# Altium project CFD_V1.03.PrjPcb (part 1 of 2)
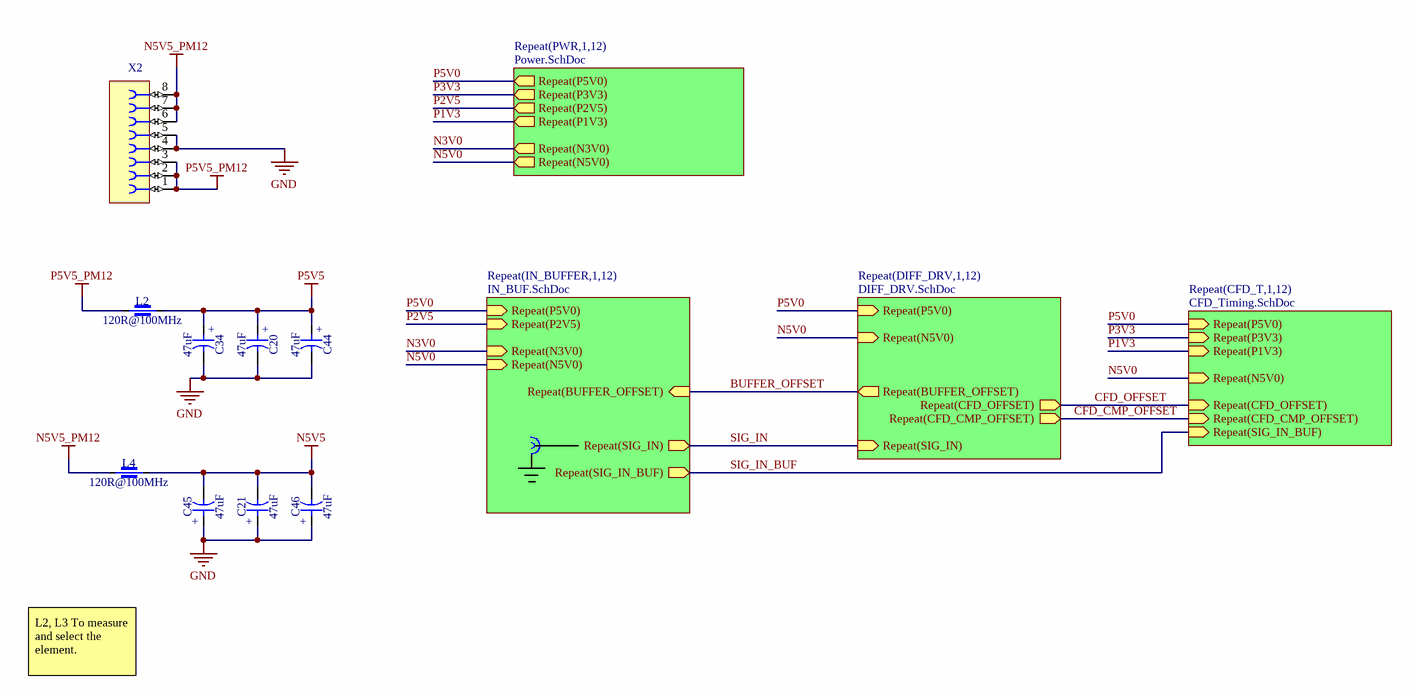
[diagram p0: CFD_V1.03_Main.SchDoc]
5 sheets, 1353 parts. Net scope: hierarchical (ports join the sheet entries above them; power ports are global).
Board file: CFD_V1.03.PcbDoc
Sheets:
  CFD_V1.03_Main.SchDoc
    PWR1 = Power.SchDoc
    PWR2 = Power.SchDoc
    PWR3 = Power.SchDoc
    PWR4 = Power.SchDoc
    PWR5 = Power.SchDoc
    PWR6 = Power.SchDoc
    PWR7 = Power.SchDoc
    PWR8 = Power.SchDoc
    PWR9 = Power.SchDoc
    PWR10 = Power.SchDoc
    PWR11 = Power.SchDoc
    PWR12 = Power.SchDoc
    IN_BUFFER1 = IN_BUF.SchDoc
    IN_BUFFER2 = IN_BUF.SchDoc
    IN_BUFFER3 = IN_BUF.SchDoc
    IN_BUFFER4 = IN_BUF.SchDoc
    IN_BUFFER5 = IN_BUF.SchDoc
    IN_BUFFER6 = IN_BUF.SchDoc
    IN_BUFFER7 = IN_BUF.SchDoc
    IN_BUFFER8 = IN_BUF.SchDoc
    IN_BUFFER9 = IN_BUF.SchDoc
    IN_BUFFER10 = IN_BUF.SchDoc
    IN_BUFFER11 = IN_BUF.SchDoc
    IN_BUFFER12 = IN_BUF.SchDoc
    DIFF_DRV1 = DIFF_DRV.SchDoc
    DIFF_DRV2 = DIFF_DRV.SchDoc
    DIFF_DRV3 = DIFF_DRV.SchDoc
    DIFF_DRV4 = DIFF_DRV.SchDoc
    DIFF_DRV5 = DIFF_DRV.SchDoc
    DIFF_DRV6 = DIFF_DRV.SchDoc
    DIFF_DRV7 = DIFF_DRV.SchDoc
    DIFF_DRV8 = DIFF_DRV.SchDoc
    DIFF_DRV9 = DIFF_DRV.SchDoc
    DIFF_DRV10 = DIFF_DRV.SchDoc
    DIFF_DRV11 = DIFF_DRV.SchDoc
    DIFF_DRV12 = DIFF_DRV.SchDoc
    CFD_T1 = CFD_Timing.SchDoc
    CFD_T2 = CFD_Timing.SchDoc
    CFD_T3 = CFD_Timing.SchDoc
    CFD_T4 = CFD_Timing.SchDoc
    CFD_T5 = CFD_Timing.SchDoc
    CFD_T6 = CFD_Timing.SchDoc
    CFD_T7 = CFD_Timing.SchDoc
    CFD_T8 = CFD_Timing.SchDoc
    CFD_T9 = CFD_Timing.SchDoc
    CFD_T10 = CFD_Timing.SchDoc
    CFD_T11 = CFD_Timing.SchDoc
    CFD_T12 = CFD_Timing.SchDoc

## Sheet CFD_V1.03_Main.SchDoc: ALICE FIT CFD Mezzanine
size 420 x 297 mm; CheckedBy: G.Kasprowicz; Author: INR Moscow; CompanyName: WUT ISE; DrawnBy: Maciej Podgóski; Organization: WUT ISE; Address1: PW ISE; Address2: Nowowiejska 15/19 00-665 Warsaw; Address3: gkasprow@gmail.com; DocumentNumber: 1; Revision: 2; SheetNumber: 1; SheetTotal: 5; ModifiedBy: -; CheckedDate: -; Title2: Top entity; DivGrp: WUT ISE; Designer: INR Moscow; ModifiedDate: -; ProjectName: Sensor Box

### Parts
C20  47uF  [CAPAE530X610N]
C21  47uF  [CAPAE530X610N]
C34  47uF  [CAPAE530X610N]
C44  47uF  [CAPAE530X610N]
C45  47uF  [CAPAE530X610N]
C46  47uF  [CAPAE530X610N]
L2  120R@100MHz  [IND_MURATA_BLM31KN]
L4  120R@100MHz  [IND_MURATA_BLM31KN]
X2  Socket 8  [SAMTEC_CES-108-01-T-S]  (value not drawn)

### Sub-sheets
Repeat(CFD_T,1,12) = CFD_Timing.SchDoc: Repeat(SIG_IN_BUF) (in), Repeat(CFD_CMP_OFFSET) (in), Repeat(P5V0) (in), Repeat(P3V3) (in), Repeat(P1V3) (in), Repeat(N5V0) (in), Repeat(CFD_OFFSET) (in)
Repeat(DIFF_DRV,1,12) = DIFF_DRV.SchDoc: Repeat(SIG_IN) (in), Repeat(BUFFER_OFFSET) (out), Repeat(CFD_CMP_OFFSET) (out), Repeat(P5V0) (in), Repeat(N5V0) (in), Repeat(CFD_OFFSET) (out)
Repeat(IN_BUFFER,1,12) = IN_BUF.SchDoc: Repeat(SIG_IN_BUF) (out), Repeat(SIG_IN) (out), Repeat(BUFFER_OFFSET) (in), Repeat(P5V0) (in), Repeat(P2V5) (in), Repeat(N5V0) (in), Repeat(N3V0) (in)
Repeat(PWR,1,12) = Power.SchDoc: Repeat(P5V0) (out), Repeat(P3V3) (out), Repeat(P2V5) (out), Repeat(P1V3) (out), Repeat(N3V0) (out), Repeat(N5V0) (out)

### Nets
GND: C20.2 C21.1 C34.2 C44.2 C45.1 C46.1 X2.4 X2.5
N5V5: C21.2 C45.2 C46.2 L4.2
N5V5_PM12: L4.1 X2.6 X2.7 X2.8
P5V5: C20.1 C34.1 C44.1 L2.2
P5V5_PM12: L2.1 X2.1 X2.2 X2.3
BUFFER_OFFSET: sheet Repeat(IN_BUFFER,1,12)/Repeat(BUFFER_OFFSET), sheet Repeat(DIFF_DRV,1,12)/Repeat(BUFFER_OFFSET)
CFD_CMP_OFFSET: sheet Repeat(DIFF_DRV,1,12)/Repeat(CFD_CMP_OFFSET), sheet Repeat(CFD_T,1,12)/Repeat(CFD_CMP_OFFSET)
CFD_OFFSET: sheet Repeat(DIFF_DRV,1,12)/Repeat(CFD_OFFSET), sheet Repeat(CFD_T,1,12)/Repeat(CFD_OFFSET)
N3V0: sheet Repeat(PWR,1,12)/Repeat(N3V0), sheet Repeat(IN_BUFFER,1,12)/Repeat(N3V0)
N5V0: sheet Repeat(PWR,1,12)/Repeat(N5V0), sheet Repeat(IN_BUFFER,1,12)/Repeat(N5V0), sheet Repeat(DIFF_DRV,1,12)/Repeat(N5V0), sheet Repeat(CFD_T,1,12)/Repeat(N5V0)
P1V3: sheet Repeat(PWR,1,12)/Repeat(P1V3), sheet Repeat(CFD_T,1,12)/Repeat(P1V3)
P2V5: sheet Repeat(PWR,1,12)/Repeat(P2V5), sheet Repeat(IN_BUFFER,1,12)/Repeat(P2V5)
P3V3: sheet Repeat(PWR,1,12)/Repeat(P3V3), sheet Repeat(CFD_T,1,12)/Repeat(P3V3)
P5V0: sheet Repeat(PWR,1,12)/Repeat(P5V0), sheet Repeat(IN_BUFFER,1,12)/Repeat(P5V0), sheet Repeat(DIFF_DRV,1,12)/Repeat(P5V0), sheet Repeat(CFD_T,1,12)/Repeat(P5V0)
SIG_IN: sheet Repeat(IN_BUFFER,1,12)/Repeat(SIG_IN), sheet Repeat(DIFF_DRV,1,12)/Repeat(SIG_IN)
SIG_IN_BUF: sheet Repeat(IN_BUFFER,1,12)/Repeat(SIG_IN_BUF), sheet Repeat(CFD_T,1,12)/Repeat(SIG_IN_BUF)

### Notes on the sheet
- L2, L3 To measure and select the element.
- Project/Equipment
- Document
- Designer
- Drawn by
- Check.by
- Copyright WUT ISE 2024.
  This documentation describes Open Hardware and is licensed under the CERN OHL v.2. You may redistribute and modify this documentation under the terms of the CERN OHL v.2. (http://ohwr.org/CERNOHL). This documentation is distributed WITHOUT ANY EXPRESS OR IMPLIED WARRANTY, INCLUDING OF MERCHANTABILITY, SATISFACTORY QUALITY AND FITNESS FOR A PARTICULAR PURPOSE. Please see the CERN OHL v.2 for applicable conditions.
- Contact
- File
- Last Mod.
- Print Date
- Sheet
- Size
- A3
- of
- Rev
- (in symbol CAE530-610_47UF_16V_20%) +

### Library data of the parts
C20 C21 C34 C44-C46 = CAE530-610_47UF_16V_20%: Polarised capacitor; Part Description: Conductive Polymer Hybrid Aluminum Electrolytic Capacitor; Manufacturer: CHEMI-CON; Manufacturer Part Number: HHXD160ARA470ME61G; Voltage: 16V; Tolerance: ±20%; Part Number: CAE530-610_47UF_16V_20%; Component Kind: Standard; Component Type: Standard; Pin Count: 2; Value: 47uF; Status: Not Recommended; Case: C; Mounted: Yes; Socket: No; SMD: Yes; Sense: No; ComponentHeight: 6.1mm; HelpURL: \\cern.ch\dfs\Applications\Altium\Datasheets\CAE_CHIMI-CON_HXD.pdf; Author: CERN DEM HF; CreateDate: 15.04.2024; LatestRevisionDate: 15.04.2024
L2 L4 = IND1206_MURATA_BLM31KN121SN1: Part Description: SMD Chip Ferrite Bead, BLM31KN_SN Series; Manufacturer: MURATA; Power: 6A; Resistance: 0.009R; Tolerance: ±25%; Part Number: IND1206_MURATA_BLM31KN121SN1; Component Kind: Standard; Component Type: Standard; Footprint: IND_MURATA_BLM31KN1; Pin Count: 2; Value: 120R@100MHz; Manufacturer Part Number: BLM31KN121SN1; Case: 1206; Mounted: Yes; Socket: No; SMD: Yes; Sense: No; ComponentHeight: 1.8mm; HelpURL: \\cern.ch\dfs\Applications\Altium\Datasheets\IND1206_MURATA_ BLM31KN_SN.pdf; Author: CERN DEM HF; CreateDate: 05.01.2022; LatestRevisionDate: 05.01.2022
X2 = SAMTEC_CES-108-01-L-S: Connector 8 Female; Part Description: 8 Contacts, Pitch 2.54mm, Single Row Through Mount Straight Socket (Lead Length 3.25mm); Manufacturer: SAMTEC; PressFit: No; Part Number: SAMTEC_CES-108-01-L-S; Component Kind: Standard; Component Type: Standard; Pin Count: 8; Family: Socket 8; Mounted: Yes; Socket: No; SMD: No; Sense: No; Status: None; Manufacturer Part Number: CES-108-01-L-S; ComponentHeight: 5.08mm; HelpURL: \\cern.ch\dfs\Applications\Altium\Datasheets\SAMTEC_CES-108-01-T-S.pdf; Author: CERN DEM HF; CreateDate: 25.04.2024; LatestRevisionDate: 25.04.2024

## Sheet Power.SchDoc: ALICE FIT CFD Mezzanine
size 420 x 297 mm; CheckedBy: G.Kasprowicz; Author: INR Moscow; CompanyName: WUT ISE; DrawnBy: Maciej Podgóski; Organization: WUT ISE; Address1: PW ISE; Address2: Nowowiejska 15/19 00-665 Warsaw; Address3: gkasprow@gmail.com; DocumentNumber: 4; Revision: 2; SheetNumber: 4; SheetTotal: 5; ModifiedBy: -; CheckedDate: -; Title2: Power supply; DivGrp: WUT ISE; Designer: INR Moscow; ModifiedDate: -; ProjectName: Sensor Box
Used 12 times, as channels PWR1, PWR2, PWR3, PWR4, PWR5, PWR6, PWR7, PWR8, PWR9, PWR10, PWR11, PWR12. Parts and nets are listed once, with the designators drawn on the sheet.
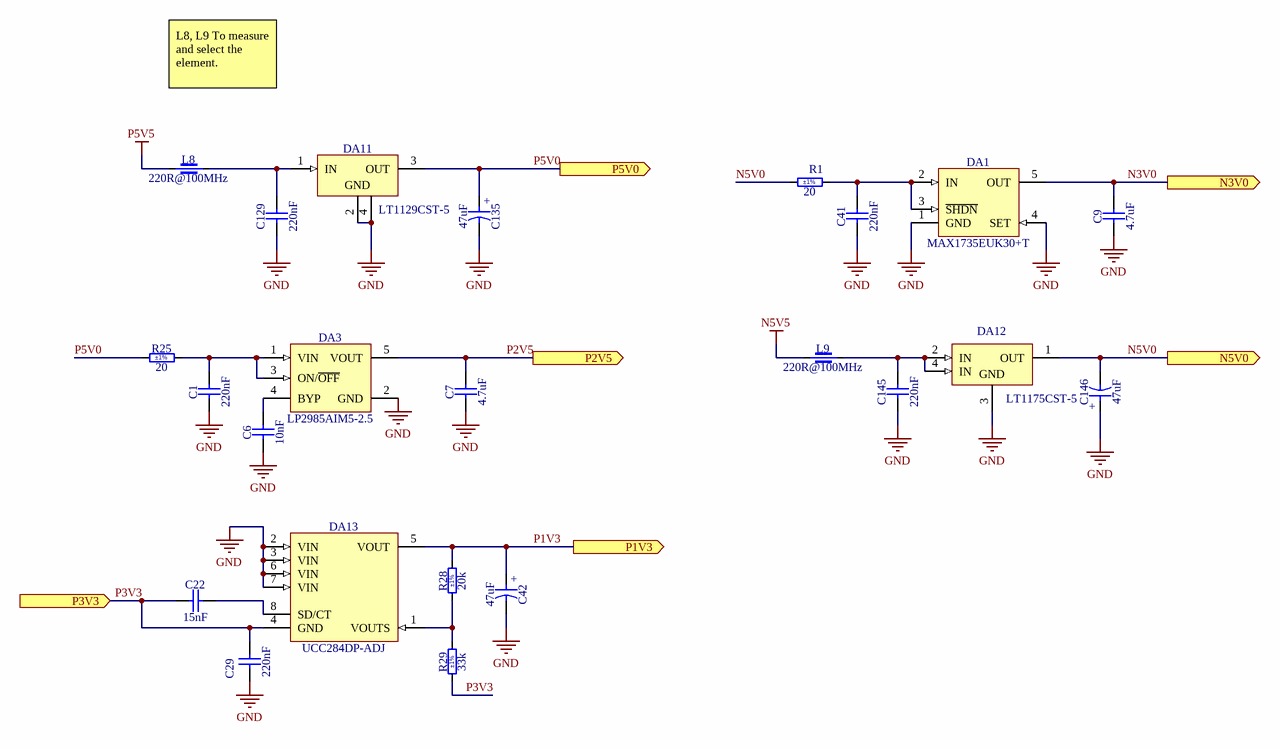
[diagram p1: Power.SchDoc]

### Parts
C1  220nF  [CAPC2012X135N]
C6  10nF  [CAPC2012X135N]
C7  4.7uF  [CAPC2012X135N]
C9  4.7uF  [CAPC2012X135N]
C22  15nF  [CAPC2012X135N]
C29  220nF  [CAPC2012X135N]
C41  220nF  [CAPC2012X135N]
C42  47uF  [CAPAE530X610N]
C129  220nF  [CAPC2012X135N]
C135  47uF  [CAPAE530X610N]
C145  220nF  [CAPC2012X135N]
C146  47uF  [CAPAE530X610N]
DA1  MAX1735EUK30+T  [SOT95P280X145-5N]
DA3  LP2985AIM5-2.5  [SOT95P280X145-5N]
DA11  LT1129CST-5  [SOT230P700X180-4N]
DA12  LT1175CST-5  [SOT230P700X180-4N]
DA13  UCC284DP-ADJ  [SOIC127P600X175-8N]
L8  220R@100MHz  [INDC2012X105N]
L9  220R@100MHz  [INDC2012X105N]
R1  20  Tolerance: ±1%  [RESC2012X60N]
R25  20  Tolerance: ±1%  [RESC2012X60N]
R28  20k  Tolerance: ±1%  [RESC2012X60N]
R29  33k  Tolerance: ±1%  [RESC2012X60N]

### Ports
N3V0 (out), N5V0 (out), P1V3 (out), P2V5 (out), P3V3 (in), P5V0 (out)

### Nets
GND: C1.1 C6.1 C7.1 C9.1 C29.1 C41.1 C42.2 C129.1 C135.2 C145.1 C146.1 DA1.1(GND) DA1.4(SET) DA3.2(GND) DA11.2(GND) DA11.4(GND) DA12.3(GND) DA13.2(VIN) DA13.3(VIN) DA13.6(VIN) DA13.7(VIN)
N5V5: L9.1
P5V5: L8.1
N3V0: C9.2 DA1.5(OUT) ; port N3V0
N5V0: C146.2 DA12.1(OUT) R1.1 ; port N5V0
P1V3: C42.1 DA13.5(VOUT) R28.2 ; port P1V3
P2V5: C7.2 DA3.5(VOUT) ; port P2V5
P3V3: C22.1 C29.2 DA13.4(GND) R29.1 ; port P3V3
P5V0: C135.1 DA11.3(OUT) R25.1 ; port P5V0
NetC1_2: C1.2 DA3.1(VIN) DA3.3(ON/~{OFF}) R25.2
NetC6_2: C6.2 DA3.4(BYP)
NetC22_2: C22.2 DA13.8(SD/CT)
NetC41_2: C41.2 DA1.2(IN) DA1.3(~{SHDN}) R1.2
NetC129_2: C129.2 DA11.1(IN) L8.2
NetC145_2: C145.2 DA12.2(IN) DA12.4(IN) L9.2
NetDA13_1: DA13.1(VOUTS) R28.1 R29.2

### Channels
PWR1: designators end in A; ports N3V0=N3V0 N5V0=N5V0 P1V3=P1V3 P2V5=P2V5 P3V3=P3V3 P5V0=P5V0
PWR2: designators end in B; ports N3V0=N3V0 N5V0=N5V0 P1V3=P1V3 P2V5=P2V5 P3V3=P3V3 P5V0=P5V0
PWR3: designators end in C; ports N3V0=N3V0 N5V0=N5V0 P1V3=P1V3 P2V5=P2V5 P3V3=P3V3 P5V0=P5V0
PWR4: designators end in D; ports N3V0=N3V0 N5V0=N5V0 P1V3=P1V3 P2V5=P2V5 P3V3=P3V3 P5V0=P5V0
PWR5: designators end in E; ports N3V0=N3V0 N5V0=N5V0 P1V3=P1V3 P2V5=P2V5 P3V3=P3V3 P5V0=P5V0
PWR6: designators end in F; ports N3V0=N3V0 N5V0=N5V0 P1V3=P1V3 P2V5=P2V5 P3V3=P3V3 P5V0=P5V0
PWR7: designators end in G; ports N3V0=N3V0 N5V0=N5V0 P1V3=P1V3 P2V5=P2V5 P3V3=P3V3 P5V0=P5V0
PWR8: designators end in H; ports N3V0=N3V0 N5V0=N5V0 P1V3=P1V3 P2V5=P2V5 P3V3=P3V3 P5V0=P5V0
PWR9: designators end in I; ports N3V0=N3V0 N5V0=N5V0 P1V3=P1V3 P2V5=P2V5 P3V3=P3V3 P5V0=P5V0
PWR10: designators end in J; ports N3V0=N3V0 N5V0=N5V0 P1V3=P1V3 P2V5=P2V5 P3V3=P3V3 P5V0=P5V0
PWR11: designators end in K; ports N3V0=N3V0 N5V0=N5V0 P1V3=P1V3 P2V5=P2V5 P3V3=P3V3 P5V0=P5V0
PWR12: designators end in L; ports N3V0=N3V0 N5V0=N5V0 P1V3=P1V3 P2V5=P2V5 P3V3=P3V3 P5V0=P5V0

### Notes on the sheet
- L8, L9 To measure and select the element.
- Project/Equipment
- Document
- Designer
- Drawn by
- Check.by
- Copyright WUT ISE 2024.
  This documentation describes Open Hardware and is licensed under the CERN OHL v.2. You may redistribute and modify this documentation under the terms of the CERN OHL v.2. (http://ohwr.org/CERNOHL). This documentation is distributed WITHOUT ANY EXPRESS OR IMPLIED WARRANTY, INCLUDING OF MERCHANTABILITY, SATISFACTORY QUALITY AND FITNESS FOR A PARTICULAR PURPOSE. Please see the CERN OHL v.2 for applicable conditions.
- Contact
- File
- Last Mod.
- Print Date
- Sheet
- Size
- A3
- of
- Rev
- (in symbol CAE530-610_47UF_16V_20%) +

### Library data of the parts
C1 C29 C41 C129 C145 = CC0805_220NF_50V_10%_X7R: Non-polarised capacitor; Part Description: SMD Multilayer Chip Ceramic Capacitor; Manufacturer: GENERIC; Manufacturer1 Part Number: GRM21BR71H224KA01L; Voltage: 50V; TC: X7R; Tolerance: ±10%; Part Number: CC0805_220NF_50V_10%_X7R; Component Kind: Standard; Component Type: Standard; Pin Count: 2; Value: 220nF; Status: Preferred; Manufacturer Part Number: CC0805_220NF_50V_10%_X7R; Case: 0805; Mounted: Yes; Socket: No; SMD: Yes; Sense: No; Manufacturer1 Example: MURATA; Manufacturer1 ComponentHeight: 1.35mm; HelpURL: \\cern.ch\dfs\Applications\Altium\Datasheets\CC0805_X7R_MURATA.pdf; Author: CERN DEM JLC; CreateDate: 03.12.2007; LatestRevisionDate: 03.12.2007
C6 = CC0805_10NF_50V_5%_C0G: Non-polarised capacitor; Part Description: SMD Multilayer Chip Ceramic Capacitor; Manufacturer: GENERIC; Manufacturer1 Part Number: C0805C103J5GACTU; Voltage: 50V; TC: C0G/NP0; Tolerance: ±5%; Part Number: CC0805_10NF_50V_5%_C0G; Component Kind: Standard; Component Type: Standard; Pin Count: 2; Value: 10nF; Status: None; Manufacturer Part Number: CC0805_10NF_50V_5%_C0G; Case: 0805; Mounted: Yes; Socket: No; SMD: Yes; Sense: No; Manufacturer1 Example: KEMET; Manufacturer1 ComponentHeight: 0.88mm; HelpURL: \\cern.ch\dfs\Applications\Altium\Datasheets\CC0805_C0G_KEMET_(Commercial Grade).pdf; Author: CERN DEM JLC; CreateDate: 02.02.2011; LatestRevisionDate: 22.04.2015
C7 C9 = CC0805_4.7UF_16V_10%_X7R: Non-polarised capacitor; Part Description: SMD Multilayer Chip Ceramic Capacitor; Manufacturer: GENERIC; Manufacturer1 Part Number: EMK212B7475KG-T; Voltage: 16V; TC: X7R; Tolerance: ±10%; Part Number: CC0805_4.7UF_16V_10%_X7R; Component Kind: Standard; Component Type: Standard; Pin Count: 2; Value: 4.7uF; Status: Preferred; Manufacturer Part Number: CC0805_4.7UF_16V_10%_X7R; Case: 0805; Mounted: Yes; Socket: No; SMD: Yes; Sense: No; Manufacturer1 Example: TAIYO YUDEN; Manufacturer1 ComponentHeight: 1.35mm; HelpURL: \\cern.ch\dfs\Applications\Altium\Datasheets\CC0805_X7R_TAIYO-YUDEN_HIGH-VALUE.pdf; Author: CERN DEM JLC; CreateDate: 16.09.2014; LatestRevisionDate: 16.09.2014
C22 = CC0805_15NF_50V_10%_X7R: Non-polarised capacitor; Part Description: SMD Multilayer Chip Ceramic Capacitor; Manufacturer: GENERIC; Manufacturer1 Part Number: 223858615638; Voltage: 50V; TC: X7R; Tolerance: ±10%; Part Number: CC0805_15NF_50V_10%_X7R; Component Kind: Standard; Component Type: Standard; Pin Count: 2; Value: 15nF; Status: Preferred; Manufacturer Part Number: CC0805_15NF_50V_10%_X7R; Case: 0805; Mounted: Yes; Socket: No; SMD: Yes; Sense: No; Manufacturer1 Example: PHYCOMP; Manufacturer1 ComponentHeight: 1.35mm; HelpURL: \\cern.ch\dfs\Applications\Altium\Datasheets\CC0805_X7R_PHYCOMP.pdf; Author: CERN DEM JLC; CreateDate: 03.12.2007; LatestRevisionDate: 03.12.2007
C42 C135 C146 = CAE530-610_47UF_16V_20%: as C20 on sheet CFD_V1.03_Main; Part Number: CAE530-610_47UF_16V_20%; Component Kind: Standard; Component Type: Standard; Pin Count: 2; Value: 47uF; Status: Not Recommended; Case: C; Mounted: Yes; Socket: No; SMD: Yes; Sense: No; ComponentHeight: 6.1mm; HelpURL: \\cern.ch\dfs\Applications\Altium\Datasheets\CAE_CHIMI-CON_HXD.pdf; Author: CERN DEM HF; CreateDate: 15.04.2024; LatestRevisionDate: 15.04.2024
DA1 = MAX1735EUK30+T: 200mA, Negative-Output, Low-Dropout Linear Regulator; Part Description: 3V, 200mA, Negative-Output, Low-Dropout Linear Regulator; Manufacturer: MAXIM; PressFit: No; Bonding: No; Part Number: MAX1735EUK30+T; Component Kind: Standard; Component Type: Standard; Device: MAX1735EUK30+T; PackageDescription: SOT23, 0.95mm Pitch; 5 Pin, 1.60mm W X 2.90mm L X 1.45mm H body, IPC Medium Density; Manufacturer Part Number: MAX1735EUK30; Pin Count: 5; Case: SOT23-5; Mounted: Yes; Socket: No; SMD: Yes; Sense: No; ComponentHeight: 1.45mm; HelpURL: \\cern.ch\dfs\Applications\Altium\Datasheets\MAX1735EUK30+T.pdf; Author: CERN DEM JLC; CreateDate: 17.02.2010; LatestRevisionDate: 04.04.2022
DA3 = LP2985AIM5-2.5: 150mA Low-Noise Low-Dropout Regulator Whit Shutdown; Part Description: 2.5V, 150mA Low-Noise Low-Dropout Regulator Whit Shutdown; Manufacturer: TEXAS INSTRUMENTS; PressFit: No; Bonding: No; Part Number: LP2985AIM5-2.5; Component Kind: Standard; Component Type: Standard; Device: LP2985AIM5-2.5; PackageDescription: SOT23, 0.95mm Pitch; 5 Pin, 1.60mm W X 2.90mm L X 1.45mm H body, IPC Medium Density; Manufacturer Part Number: LP2985AIM5-2.5; Pin Count: 5; Case: SOT23-5; Mounted: Yes; Socket: No; SMD: Yes; Sense: No; ComponentHeight: 1.45mm; HelpURL: \\cern.ch\dfs\Applications\Altium\Datasheets\LP2985AIM5.pdf; Author: CERN DEM HF; CreateDate: 16.04.2024; LatestRevisionDate: 16.04.2024
DA11 = LT1129CST-5: 3-Terminal Regulator 1=IN 2=GND 3=OUT 4=GND; Part Description: 5V, 700mA Micropower Low Dropout Regulator with Shutdown; Manufacturer: LINEAR TECHNOLOGY; PressFit: No; Bonding: No; Part Number: LT1129CST-5; Component Kind: Standard; Component Type: Standard; Device: LT1129CST-5; PackageDescription: SOT223, 2.30mm Pitch; 4 Pin, 3.70mm W X 6.70mm L X 1.80mm H body, IPC Medium Density; Manufacturer Part Number: LT1129CST-5; Pin Count: 4; Case: SOT223; Mounted: Yes; Socket: No; SMD: Yes; Sense: No; ComponentHeight: 1.8mm; HelpURL: \\cern.ch\dfs\Applications\Altium\Datasheets\LT1129.pdf; Author: CERN DEM HF; CreateDate: 16.04.2024; LatestRevisionDate: 16.04.2024
DA12 = LT1175CST-5: 3-Terminal Regulator 1=OUT 2=IN 3=GND 4=IN; Part Description: 5V 500mA Negative Low Dropout Micropower Regulator; Manufacturer: LINEAR TECHNOLOGY; PressFit: No; Bonding: No; Part Number: LT1175CST-5; Component Kind: Standard; Component Type: Standard; Device: LT1175CST-5; PackageDescription: SOT223, 2.30mm Pitch; 4 Pin, 3.70mm W X 6.70mm L X 1.80mm H body, IPC Medium Density; Manufacturer Part Number: LT1175CST-5; Pin Count: 4; Case: SOT223; Mounted: Yes; Socket: No; SMD: Yes; Sense: No; ComponentHeight: 1.8mm; HelpURL: \\cern.ch\dfs\Applications\Altium\Datasheets\LT1175.pdf; Author: CERN DEM HF; CreateDate: 16.04.2024; LatestRevisionDate: 16.04.2024
DA13 = UCC284DP-ADJ: 5V, 500mA Low-Dropout Negative Linear Regulator; Part Description: 5V, 500mA Low-Dropout Negative Linear Regulator, Adjustable Output; Manufacturer: TEXAS INSTRUMENTS; PressFit: No; Bonding: No; Part Number: UCC284DP-ADJ; Component Kind: Standard; Component Type: Standard; Device: UCC284DP-ADJ; PackageDescription: SOIC 8, Pitch 1.27mm, Body 4x5mm, IPC Medium Density; Manufacturer Part Number: UCC284DP-ADJ; Pin Count: 8; Case: SOIC8; Mounted: Yes; Socket: No; SMD: Yes; Sense: No; ComponentHeight: 1.75mm; HelpURL: \\cern.ch\dfs\Applications\Altium\Datasheets\UCC284DP-ADJ.pdf; Author: CERN DEM BR; CreateDate: 20.06.2019; LatestRevisionDate: 20.06.2019
L8 L9 = IND0805_TDK_MPZ2012S221A: Part Description: SMT Chip Bead for General Power Line (MPZ Series); Manufacturer: TDK; Power: 3A; Resistance: 0.04R; Tolerance: ±25%; Part Number: IND0805_TDK_MPZ2012S221A; Component Kind: Standard; Component Type: Standard; Pin Count: 2; Value: 220R@100MHz; Manufacturer Part Number: MPZ2012S221A; Case: 0805; Mounted: Yes; Socket: No; SMD: Yes; Sense: No; ComponentHeight: 1.05mm; HelpURL: \\cern.ch\dfs\Applications\Altium\Datasheets\IND0805_TDK_MPZ2012.pdf; Author: CERN DEM HF; CreateDate: 04.10.2021; LatestRevisionDate: 04.10.2021
R1 R25 = R0805_20R_1%_0.125W_100PPM: Resistor - 1%; Part Description: General Purpose Thick Film Chip Resistor; Manufacturer: GENERIC; Manufacturer1 Part Number: NRC10F20R0TRF; Power: 0.125W; TC: ±100ppm/°C; PressFit: No; Part Number: R0805_20R_1%_0.125W_100PPM; Component Kind: Standard; Component Type: Standard; Pin Count: 2; Value: 20; Status: Preferred; Manufacturer Part Number: R0805_20R_1%_0.125W_100PPM; Case: 0805; Mounted: Yes; Sense: No; Socket: No; SMD: Yes; Manufacturer1 Example: NIC COMPONENT; Manufacturer1 ComponentHeight: 0.6mm; HelpURL: \\cern.ch\dfs\Applications\Altium\Datasheets\R0805_NIC_NRC.pdf; Author: CERN DEM JLC; CreateDate: 03.12.2007; LatestRevisionDate: 13.03.2008
R28 = R0805_20K_1%_0.125W_100PPM: Resistor - 1%; Part Description: General Purpose Thick Film Chip Resistor; Manufacturer: GENERIC; Manufacturer1 Part Number: NRC10F2002TRF; Power: 0.125W; TC: ±100ppm/°C; PressFit: No; Part Number: R0805_20K_1%_0.125W_100PPM; Component Kind: Standard; Component Type: Standard; Pin Count: 2; Value: 20k; Status: Preferred; Manufacturer Part Number: R0805_20K_1%_0.125W_100PPM; Case: 0805; Mounted: Yes; Sense: No; Socket: No; SMD: Yes; Manufacturer1 Example: NIC COMPONENT; Manufacturer1 ComponentHeight: 0.6mm; HelpURL: \\cern.ch\dfs\Applications\Altium\Datasheets\R0805_NIC_NRC.pdf; Author: CERN DEM JLC; CreateDate: 03.12.2007; LatestRevisionDate: 13.03.2008
R29 = R0805_33K_1%_0.125W_100PPM: Resistor - 1%; Part Description: General Purpose Thick Film Chip Resistor; Manufacturer: GENERIC; Manufacturer1 Part Number: NRC10F3302TRF; Power: 0.125W; TC: ±100ppm/°C; PressFit: No; Part Number: R0805_33K_1%_0.125W_100PPM; Component Kind: Standard; Component Type: Standard; Pin Count: 2; Value: 33k; Status: Preferred; Manufacturer Part Number: R0805_33K_1%_0.125W_100PPM; Case: 0805; Mounted: Yes; Sense: No; Socket: No; SMD: Yes; Manufacturer1 Example: NIC COMPONENT; Manufacturer1 ComponentHeight: 0.6mm; HelpURL: \\cern.ch\dfs\Applications\Altium\Datasheets\R0805_NIC_NRC.pdf; Author: CERN DEM JLC; CreateDate: 03.12.2007; LatestRevisionDate: 13.03.2008

## Sheet IN_BUF.SchDoc: ALICE FIT CFD Mezzanine
size 420 x 297 mm; CheckedBy: G.Kasprowicz; Author: INR Moscow; CompanyName: WUT ISE; DrawnBy: Maciej Podgóski; Organization: WUT ISE; Address1: PW ISE; Address2: Nowowiejska 15/19 00-665 Warsaw; Address3: gkasprow@gmail.com; DocumentNumber: 3; Revision: 2; SheetNumber: 3; SheetTotal: 5; ModifiedBy: -; CheckedDate: -; Title2: Input buffer; DivGrp: WUT ISE; Designer: INR Moscow; ModifiedDate: -; ProjectName: Sensor Box
Used 12 times, as channels IN_BUFFER1, IN_BUFFER2, IN_BUFFER3, IN_BUFFER4, IN_BUFFER5, IN_BUFFER6, IN_BUFFER7, IN_BUFFER8, IN_BUFFER9, IN_BUFFER10, IN_BUFFER11, IN_BUFFER12. Parts and nets are listed once, with the designators drawn on the sheet.
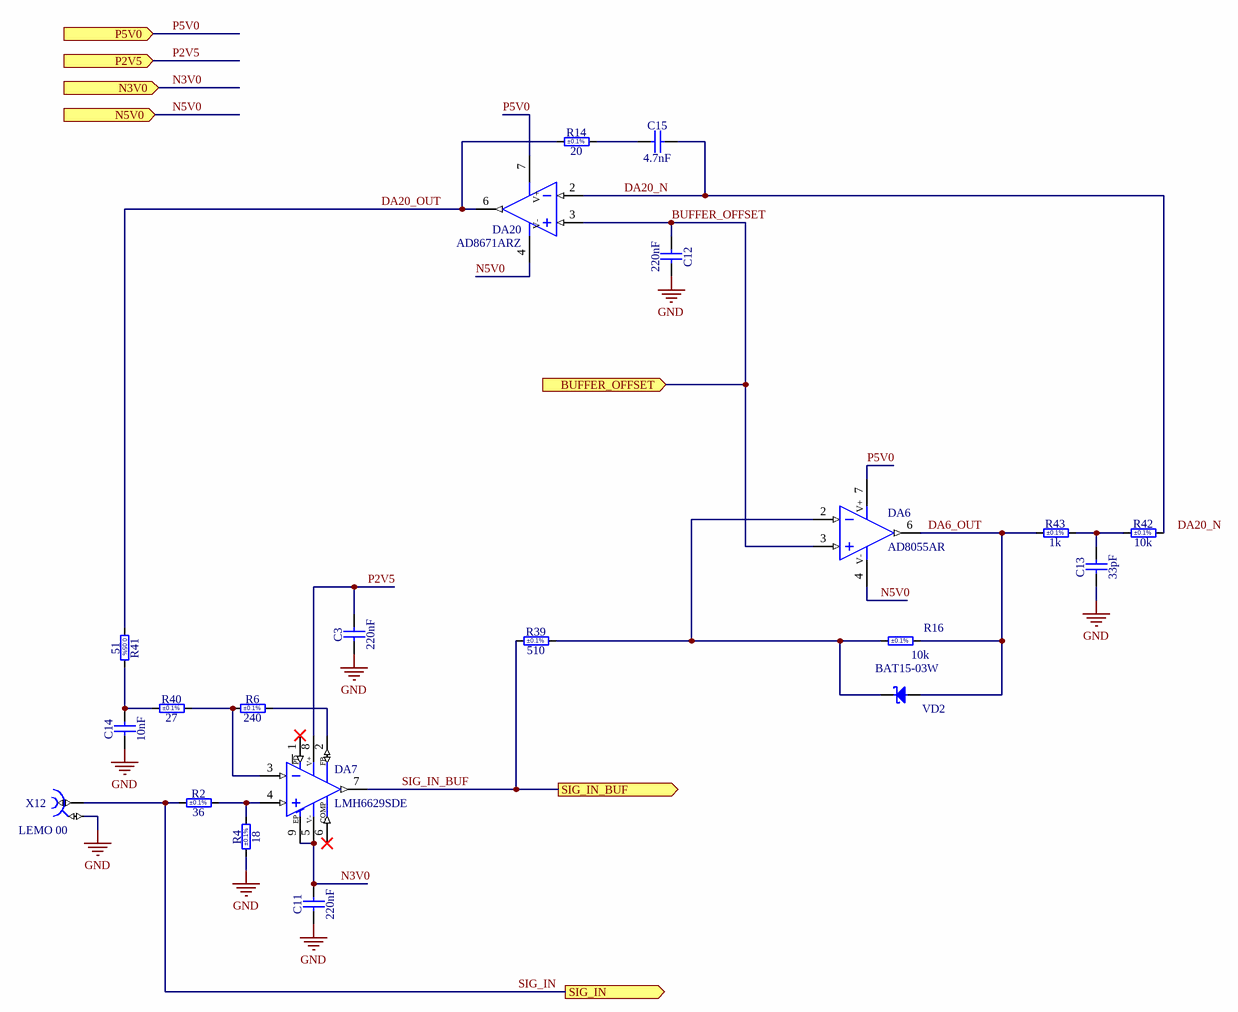
[diagram p2: IN_BUF.SchDoc]

### Parts
C3  220nF  [CAPC2012X135N]
C11  220nF  [CAPC2012X135N]
C12  220nF  [CAPC2012X135N]
C13  33pF  [CAPC2013X115N]
C14  10nF  [CAPC2012X135N]
C15  4.7nF  [CAPC2012X135N]
DA6  AD8055AR  [SOIC127P600X175-8N]
DA7  LMH6629SDE  [TEXAS_NGQ0008A]
DA20  AD8671ARZ  [SOIC127P600X175-8N]
R2  36  Tolerance: ±0.1%  [RESC1608X64N]
R4  18  Tolerance: ±0.1%  [RESC1608X64N]
R6  240  Tolerance: ±0.1%  [RESC1005X40N]
R14  20  Tolerance: ±0.1%  [RESC2012X60N]
R16  10k  Tolerance: ±0.1%  [RESC2012X60N]
R39  510  Tolerance: ±0.1%  [RESC1005X40N]
R40  27  Tolerance: ±0.1%  [RESC1608X64N]
R41  51  [RESC2012X60N]
R42  10k  Tolerance: ±0.1%  [RESC2012X60N]
R43  1k  Tolerance: ±0.1%  [RESC2012X60N]
VD2  BAT15-03W  [SOD2512X110N]
X12  LEMO 00  [LEMO_EPL.00.250.NTN]

### Ports
BUFFER_OFFSET (in), N3V0 (in), N5V0 (in), P2V5 (in), P5V0 (in), SIG_IN (out), SIG_IN_BUF (out)

### Nets
GND: C3.1 C11.1 C12.1 C13.1 C14.1 R4.1 X12.2
BUFFER_OFFSET: C12.2 DA6.3(IN+) DA20.3(IN+) ; port BUFFER_OFFSET
DA6_OUT: DA6.6(OUT) R16.1 R43.1 VD2.2(A)
DA20_N: C15.1 DA20.2(IN-) R42.2
DA20_OUT: DA20.6(OUT) R14.2 R41.1
N3V0: C11.2 DA7.5(V-) DA7.9(EP) ; port N3V0
N5V0: DA6.4(V-) DA20.4(V-) ; port N5V0
P2V5: C3.2 DA7.8(V+) ; port P2V5
P5V0: DA6.7(V+) DA20.7(V+) ; port P5V0
SIG_IN: R2.1 X12.1 ; port SIG_IN
SIG_IN_BUF: DA7.7(OUT) R39.1 ; port SIG_IN_BUF
NetC13_2: C13.2 R42.1 R43.2
NetC14_2: C14.2 R40.1 R41.2
NetC15_2: C15.2 R14.1
NetDA6_2: DA6.2(IN-) R16.2 R39.2 VD2.1(C)
NetDA7_2: DA7.2(FB) R6.2
NetDA7_3: DA7.3(IN-) R6.1 R40.2
NetDA7_4: DA7.4(IN+) R2.2 R4.2

Not connected (* = marked no-connect by the designer): DA7 1(~{PD})* 6(COMP)*

### Channels
IN_BUFFER1: designators end in A; ports BUFFER_OFFSET=BUFFER_OFFSET N3V0=N3V0 N5V0=N5V0 P2V5=P2V5 P5V0=P5V0 SIG_IN=SIG_IN SIG_IN_BUF=SIG_IN_BUF
IN_BUFFER2: designators end in B; ports BUFFER_OFFSET=BUFFER_OFFSET N3V0=N3V0 N5V0=N5V0 P2V5=P2V5 P5V0=P5V0 SIG_IN=SIG_IN SIG_IN_BUF=SIG_IN_BUF
IN_BUFFER3: designators end in C; ports BUFFER_OFFSET=BUFFER_OFFSET N3V0=N3V0 N5V0=N5V0 P2V5=P2V5 P5V0=P5V0 SIG_IN=SIG_IN SIG_IN_BUF=SIG_IN_BUF
IN_BUFFER4: designators end in D; ports BUFFER_OFFSET=BUFFER_OFFSET N3V0=N3V0 N5V0=N5V0 P2V5=P2V5 P5V0=P5V0 SIG_IN=SIG_IN SIG_IN_BUF=SIG_IN_BUF
IN_BUFFER5: designators end in E; ports BUFFER_OFFSET=BUFFER_OFFSET N3V0=N3V0 N5V0=N5V0 P2V5=P2V5 P5V0=P5V0 SIG_IN=SIG_IN SIG_IN_BUF=SIG_IN_BUF
IN_BUFFER6: designators end in F; ports BUFFER_OFFSET=BUFFER_OFFSET N3V0=N3V0 N5V0=N5V0 P2V5=P2V5 P5V0=P5V0 SIG_IN=SIG_IN SIG_IN_BUF=SIG_IN_BUF
IN_BUFFER7: designators end in G; ports BUFFER_OFFSET=BUFFER_OFFSET N3V0=N3V0 N5V0=N5V0 P2V5=P2V5 P5V0=P5V0 SIG_IN=SIG_IN SIG_IN_BUF=SIG_IN_BUF
IN_BUFFER8: designators end in H; ports BUFFER_OFFSET=BUFFER_OFFSET N3V0=N3V0 N5V0=N5V0 P2V5=P2V5 P5V0=P5V0 SIG_IN=SIG_IN SIG_IN_BUF=SIG_IN_BUF
IN_BUFFER9: designators end in I; ports BUFFER_OFFSET=BUFFER_OFFSET N3V0=N3V0 N5V0=N5V0 P2V5=P2V5 P5V0=P5V0 SIG_IN=SIG_IN SIG_IN_BUF=SIG_IN_BUF
IN_BUFFER10: designators end in J; ports BUFFER_OFFSET=BUFFER_OFFSET N3V0=N3V0 N5V0=N5V0 P2V5=P2V5 P5V0=P5V0 SIG_IN=SIG_IN SIG_IN_BUF=SIG_IN_BUF
IN_BUFFER11: designators end in K; ports BUFFER_OFFSET=BUFFER_OFFSET N3V0=N3V0 N5V0=N5V0 P2V5=P2V5 P5V0=P5V0 SIG_IN=SIG_IN SIG_IN_BUF=SIG_IN_BUF
IN_BUFFER12: designators end in L; ports BUFFER_OFFSET=BUFFER_OFFSET N3V0=N3V0 N5V0=N5V0 P2V5=P2V5 P5V0=P5V0 SIG_IN=SIG_IN SIG_IN_BUF=SIG_IN_BUF

### Notes on the sheet
- Labels drawn without touching a wire or pin: DA20_N
- Project/Equipment
- Document
- Designer
- Drawn by
- Check.by
- Copyright WUT ISE 2024.
  This documentation describes Open Hardware and is licensed under the CERN OHL v.2. You may redistribute and modify this documentation under the terms of the CERN OHL v.2. (http://ohwr.org/CERNOHL). This documentation is distributed WITHOUT ANY EXPRESS OR IMPLIED WARRANTY, INCLUDING OF MERCHANTABILITY, SATISFACTORY QUALITY AND FITNESS FOR A PARTICULAR PURPOSE. Please see the CERN OHL v.2 for applicable conditions.
- Contact
- File
- Last Mod.
- Print Date
- Sheet
- Size
- A3
- of
- Rev
- (in symbol LMH6629SDE) PD
- (in symbol R0805_51R_0.05%_0.125W_10PPM) 0.05%

### Library data of the parts
C3 C11 C12 = CC0805_220NF_50V_10%_X7R: as C1 on sheet Power; Part Number: CC0805_220NF_50V_10%_X7R; Component Kind: Standard; Component Type: Standard; Pin Count: 2; Value: 220nF; Status: Preferred; Manufacturer Part Number: CC0805_220NF_50V_10%_X7R; Case: 0805; Mounted: Yes; Socket: No; SMD: Yes; Sense: No; Manufacturer1 Example: MURATA; Manufacturer1 ComponentHeight: 1.35mm; HelpURL: \\cern.ch\dfs\Applications\Altium\Datasheets\CC0805_X7R_MURATA.pdf; Author: CERN DEM JLC; CreateDate: 03.12.2007; LatestRevisionDate: 03.12.2007
C13 = CC0805_33PF_200V_1%_NP0: Non-polarised capacitor; Part Description: SMD Multilayer Chip Ceramic Capacitor; Manufacturer: GENERIC; Manufacturer1 Part Number: KGQ21HCG2D330FT; Voltage: 200V; TC: C0G/NP0; Tolerance: ±1%; Part Number: CC0805_33PF_200V_1%_NP0; Component Kind: Standard; Component Type: Standard; Pin Count: 2; Value: 33pF; Status: None; Manufacturer Part Number: CC0805_33PF_200V_1%_NP0; Case: 0805; Mounted: Yes; Socket: No; SMD: Yes; Sense: No; Manufacturer1 Example: AVX; Manufacturer1 ComponentHeight: 1.15mm; HelpURL: \\cern.ch\dfs\Applications\Altium\Datasheets\CC0805_NP0_AVX_KGQ.pdf; Author: CERN DEM HF; CreateDate: 15.04.2024; LatestRevisionDate: 15.04.2024
C14 = CC0805_10NF_50V_2%_C0G: Non-polarised capacitor; Part Description: SMD Multilayer Chip Ceramic Capacitor; Manufacturer: GENERIC; Manufacturer1 Part Number: 0805N103G500CT; Voltage: 50V; TC: C0G/NP0; Tolerance: ±2%; Part Number: CC0805_10NF_50V_2%_C0G; Component Kind: Standard; Component Type: Standard; Pin Count: 2; Value: 10nF; Status: None; Manufacturer Part Number: CC0805_10NF_50V_2%_C0G; Case: 0805; Mounted: Yes; Socket: No; SMD: Yes; Sense: No; Manufacturer1 Example: Walsin Technology Corporation; Manufacturer1 ComponentHeight: 1.35mm; HelpURL: \\cern.ch\dfs\Applications\Altium\Datasheets\CC0805_C0G_Walsin.pdf; Author: CERN DEM HF; CreateDate: 15.04.2024; LatestRevisionDate: 15.04.2024
C15 = CC0805_4.7NF_250V_1%_NP0: Non-polarised capacitor; Part Description: SMD Multilayer Chip Ceramic Capacitor; Manufacturer: GENERIC; Manufacturer Part Number: CC0805_4.7NF_250V_1%_X7R; Manufacturer1 Part Number: GCM21B5C2E472FX01L; Voltage: 250V; TC: NP0; Tolerance: ±1%; Part Number: CC0805_4.7NF_250V_1%_NP0; Component Kind: Standard; Component Type: Standard; Pin Count: 2; Value: 4.7nF; Status: None; Case: 0805; Mounted: Yes; Socket: No; SMD: Yes; Sense: No; Manufacturer1 Example: MURATA; Manufacturer1 ComponentHeight: 1.45mm; HelpURL: \\cern.ch\dfs\Applications\Altium\Datasheets\CC0805_MURATA_GCM21B5C2E472FX01L.pdf; Author: CERN DEM HF; CreateDate: 15.04.2024; LatestRevisionDate: 15.04.2024
DA6 = AD8055AR: Operational Amplifier; Part Description: Low Cost, 300 MHz Voltage Feedback Amplifier; Manufacturer: ANALOG DEVICES; PressFit: No; Bonding: No; Part Number: AD8055AR; Component Kind: Standard; Component Type: Standard; Device: AD8055AR; PackageDescription: SOIC 8, Pitch 1.27mm - Body 4x5mm, IPC Medium Density; Manufacturer Part Number: AD8055AR; Pin Count: 8; Case: SOIC8; Mounted: Yes; Socket: No; SMD: Yes; Sense: No; ComponentHeight: 1.75mm; Author: CERN DEM HF; HelpURL: \\cern.ch\dfs\Applications\Altium\Datasheets\AD8055.pdf; CreateDate: 15.04.2024; LatestRevisionDate: 15.04.2024
DA7 = LMH6629SDE: Ultra-Low Noise, High-Speed Operational Amplifier with Shutdown; Manufacturer: TEXAS INSTRUMENTS; PressFit: No; Bonding: No; Part Number: LMH6629SDE; Component Kind: Standard; Component Type: Standard; Device: LMH6629SDE; PackageDescription: TEXAS Case Style NGQ(WSON-N9), SON, 0.50mm Pitch, Square; 8 Pin, 3.00mm L X 3.00mm W X 0.80mm H body (w/Thermal Tab 1.70 X 2.10mm); Part Description: Ultra-Low Noise, High-Speed Operational Amplifier with Shutdown; Manufacturer Part Number: LMH6629SDE; Pin Count: 9; Case: SON8; Mounted: Yes; Socket: No; SMD: Yes; Sense: No; ComponentHeight: 0.8mm; Author: CERN DEM HF; HelpURL: \\cern.ch\dfs\Applications\Altium\Datasheets\LMH6629.pdf; CreateDate: 12.06.2023; LatestRevisionDate: 12.06.2023
DA20 = AD8671ARZ: Operational Amplifier; Part Description: Precision, Very Low Noise, Low Input Bias Current Operational Amplifier; Manufacturer: ANALOG DEVICES; PressFit: No; Bonding: No; Part Number: AD8671ARZ; Component Kind: Standard; Component Type: Standard; Device: AD8671ARZ; PackageDescription: SOIC 8, Pitch 1.27mm - Body 4x5mm, IPC Medium Density; Manufacturer Part Number: AD8671AR; Pin Count: 8; Case: SOIC8; Mounted: Yes; Socket: No; SMD: Yes; Sense: No; ComponentHeight: 1.75mm; Author: CERN DEM JLC; HelpURL: \\cern.ch\dfs\Applications\Altium\Datasheets\AD8671ARZ.pdf; CreateDate: 17.06.2014; LatestRevisionDate: 31.03.2022
R2 = R0603_36R_0.1%_0.1W_10PPM: Resistor - 0.1%; Part Description: Thin Film Chip Resistor; Manufacturer: GENERIC; Manufacturer1 Part Number: RT0603BRC0736RL; Power: 0.1W; TC: ±10ppm/°C; PressFit: No; Part Number: R0603_36R_0.1%_0.1W_10PPM; Component Kind: Standard; Component Type: Standard; Pin Count: 2; Value: 36; Status: Not Recommended; Manufacturer Part Number: R0603_36R_0.1%_0.1W_10PPM; Case: 0603; Mounted: Yes; Sense: No; Socket: No; SMD: Yes; Manufacturer1 Example: YAGEO; Manufacturer1 ComponentHeight: 0.55mm; HelpURL: \\cern.ch\dfs\Applications\Altium\Datasheets\R0603_YAGEO_RT.pdf; Author: CERN DEM HF; CreateDate: 25.04.2024; LatestRevisionDate: 25.04.2024
R4 = R0603_18R_0.1%_0.1W_25PPM: Resistor - 0.1%; Part Description: Thin Film Chip Resistor; Manufacturer: GENERIC; Manufacturer1 Part Number: RT0603BRD0718RL; Power: 0.1W; TC: ±25ppm/°C; PressFit: No; Part Number: R0603_18R_0.1%_0.1W_25PPM; Component Kind: Standard; Component Type: Standard; Pin Count: 2; Value: 18; Status: Not Recommended; Manufacturer Part Number: R0603_18R_0.1%_0.1W_25PPM; Case: 0603; Mounted: Yes; Sense: No; Socket: No; SMD: Yes; Manufacturer1 Example: YAGEO; Manufacturer1 ComponentHeight: 0.55mm; HelpURL: \\cern.ch\dfs\Applications\Altium\Datasheets\R0603_YAGEO_RT.pdf; Author: CERN DEM HF; CreateDate: 25.04.2024; LatestRevisionDate: 25.04.2024
R6 = R0402_240R_0.1%_0.0625W_10PPM: Resistor - 0.1%; Part Description: Thick Film Chip Resistor; Manufacturer: GENERIC; Manufacturer1 Part Number: ERA2ARB241X; Power: 0.063W; TC: ±10ppm/°C; PressFit: No; Part Number: R0402_240R_0.1%_0.0625W_10PPM; Component Kind: Standard; Component Type: Standard; Pin Count: 2; Value: 240; Status: Not Recommended; Manufacturer Part Number: R0402_240R_0.1%_0.0625W_10PPM; Case: 0402; Mounted: Yes; Sense: No; Socket: No; SMD: Yes; Manufacturer1 Example: PANASONIC; Manufacturer1 ComponentHeight: 0.4mm; HelpURL: \\cern.ch\dfs\Applications\Altium\Datasheets\R0402_PANASONIC_ERA.pdf; Author: CERN DEM HF; CreateDate: 25.04.2024; LatestRevisionDate: 25.04.2024
R14 = R0805_20R_0.1%_0.1W_10PPM: Resistor - 0.1%; Part Description: Thin Film Chip Resistor; Manufacturer: GENERIC; Manufacturer1 Part Number: RN73C2A20RBTG; Power: 0.1W; TC: ±10ppm; PressFit: No; Part Number: R0805_20R_0.1%_0.1W_10PPM; Component Kind: Standard; Component Type: Standard; Pin Count: 2; Value: 20; Status: Not Recommended; Manufacturer Part Number: R0805_20R_0.1%_0.1W_10PPM; Case: 0805; Mounted: Yes; Sense: No; Socket: No; SMD: Yes; Manufacturer1 Example: TYCO HOLSWORTHY; Manufacturer1 ComponentHeight: 0.6mm; HelpURL: \\cern.ch\dfs\Applications\Altium\Datasheets\R0805_Tyco_RN73.pdf; Author: CERN DEM JLC; CreateDate: 03.12.2007; LatestRevisionDate: 13.03.2008
R16 R42 = R0805_10K_0.1%_0.1W_10PPM: Resistor - 0.1%; Part Description: Thin Film Chip Resistor; Manufacturer: GENERIC; Manufacturer1 Part Number: RN73C2A10KBTG; Power: 0.1W; TC: ±10ppm; PressFit: No; Part Number: R0805_10K_0.1%_0.1W_10PPM; Component Kind: Standard; Component Type: Standard; Pin Count: 2; Value: 10k; Status: Not Recommended; Manufacturer Part Number: R0805_10K_0.1%_0.1W_10PPM; Case: 0805; Mounted: Yes; Sense: No; Socket: No; SMD: Yes; Manufacturer1 Example: TYCO HOLSWORTHY; Manufacturer1 ComponentHeight: 0.6mm; HelpURL: \\cern.ch\dfs\Applications\Altium\Datasheets\R0805_Tyco_RN73.pdf; Author: CERN DEM JLC; CreateDate: 03.12.2007; LatestRevisionDate: 13.03.2008
R39 = R0402_510R_0.1%_0.0625W_10PPM: Resistor - 0.1%; Part Description: Thick Film Chip Resistor; Manufacturer: GENERIC; Manufacturer1 Part Number: ERA2ARB511X; Power: 0.063W; TC: ±10ppm/°C; PressFit: No; Part Number: R0402_510R_0.1%_0.0625W_10PPM; Component Kind: Standard; Component Type: Standard; Pin Count: 2; Value: 510; Status: Not Recommended; Manufacturer Part Number: R0402_510R_0.1%_0.0625W_10PPM; Case: 0402; Mounted: Yes; Sense: No; Socket: No; SMD: Yes; Manufacturer1 Example: PANASONIC; Manufacturer1 ComponentHeight: 0.4mm; HelpURL: \\cern.ch\dfs\Applications\Altium\Datasheets\R0402_PANASONIC_ERA.pdf; Author: CERN DEM HF; CreateDate: 25.04.2024; LatestRevisionDate: 25.04.2024
R40 = R0603_27R_0.1%_0.1W_10PPM: Resistor - 0.1%; Part Description: Thin Film Chip Resistor; Manufacturer: GENERIC; Manufacturer1 Part Number: RT0603BRB0727RL; Power: 0.1W; TC: ±10ppm/°C; PressFit: No; Part Number: R0603_27R_0.1%_0.1W_10PPM; Component Kind: Standard; Component Type: Standard; Pin Count: 2; Value: 27; Status: Not Recommended; Manufacturer Part Number: R0603_27R_0.1%_0.1W_10PPM; Case: 0603; Mounted: Yes; Sense: No; Socket: No; SMD: Yes; Manufacturer1 Example: YAGEO; Manufacturer1 ComponentHeight: 0.55mm; HelpURL: \\cern.ch\dfs\Applications\Altium\Datasheets\R0603_YAGEO_RT.pdf; Author: CERN DEM HF; CreateDate: 25.04.2024; LatestRevisionDate: 25.04.2024
R41 = R0805_51R_0.05%_0.125W_10PPM: Resistor - 0.05%; Part Description: Thin Film Chip Resistor; Manufacturer: GENERIC; Manufacturer1 Part Number: RG2012N-510-W-T1; Power: 0.1W; TC: ±10ppm/°C; Tolerance: ±0.1%; PressFit: No; Part Number: R0805_51R_0.05%_0.125W_10PPM; Component Kind: Standard; Component Type: Standard; Pin Count: 2; Value: 51; Status: Not Recommended; Manufacturer Part Number: R0805_51R_0.05%_0.125W_10PPM; Case: 0805; Mounted: Yes; Sense: No; Socket: No; SMD: Yes; Manufacturer1 Example: SUSUMU; Manufacturer1 ComponentHeight: 0.5mm; HelpURL: \\cern.ch\dfs\Applications\Altium\Datasheets\R0805_SUSUMU_RG.pdf; Author: CERN DEM HF; CreateDate: 25.04.2024; LatestRevisionDate: 25.04.2024
R43 = R0805_1K_0.1%_0.1W_10PPM: Resistor - 0.1%; Part Description: Thin Film Chip Resistor; Manufacturer: GENERIC; Manufacturer1 Part Number: RN73C2A1K0BTG; Power: 0.1W; TC: ±10ppm; PressFit: No; Part Number: R0805_1K_0.1%_0.1W_10PPM; Component Kind: Standard; Component Type: Standard; Pin Count: 2; Value: 1k; Status: Not Recommended; Manufacturer Part Number: R0805_1K_0.1%_0.1W_10PPM; Case: 0805; Mounted: Yes; Sense: No; Socket: No; SMD: Yes; Manufacturer1 Example: TYCO HOLSWORTHY; Manufacturer1 ComponentHeight: 0.6mm; HelpURL: \\cern.ch\dfs\Applications\Altium\Datasheets\R0805_TYCO_RN73.pdf; Author: CERN DEM JLC; CreateDate: 28.05.2013; LatestRevisionDate: 28.05.2013
VD2 = BAT15-03W: Schottky Diode; Part Description: Single Silicon RF Schottky Diode; Manufacturer: INFINEON; Device: BAT60A; Voltage: 4V; Power: 100mA; PressFit: No; Bonding: No; Part Number: BAT15-03W; Component Kind: Standard; Component Type: Standard; PackageDescription: Small Outline Diode (SOD-323), 1.70mm W X 1.25mm L X 1.10mm H body,  IPC Medium Density; Manufacturer Part Number: BAT15-03W; Pin Count: 2; Case: SOD-323; Mounted: Yes; Socket: No; SMD: Yes; Sense: No; ComponentHeight: 1.1mm; HelpURL: \\cern.ch\dfs\Applications\Altium\Datasheets\BAT15-03W.pdf; Author: CERN DEM HF; CreateDate: 15.04.2024; LatestRevisionDate: 15.04.2024
X12 = LEMO_EPL.00.250.NTN: Part Description: Size 00, 50 Ohms Coaxial Elbow (90°) socket; PressFit: No; Part Number: LEMO_EPL.00.250.NTN; Component Kind: Standard; Component Type: Standard; Pin Count: 2; Family: LEMO 00; Mounted: Yes; Socket: No; SMD: No; Sense: No; Status: Obsolete; Manufacturer: LEMO; Manufacturer Part Number: EPL.00.250.NTN; ComponentHeight: 7mm; HelpURL: \\cern.ch\dfs\Applications\Altium\Datasheets\LEMO_EPL.00.250.NTN.pdf; Author: CERN DEM JLC; CreateDate: 03.12.2007; LatestRevisionDate: 11.02.2016